# Altium schematic sheet Microcontroller.SchDoc
size A4; SheetNumber: 1; SheetTotal: 4
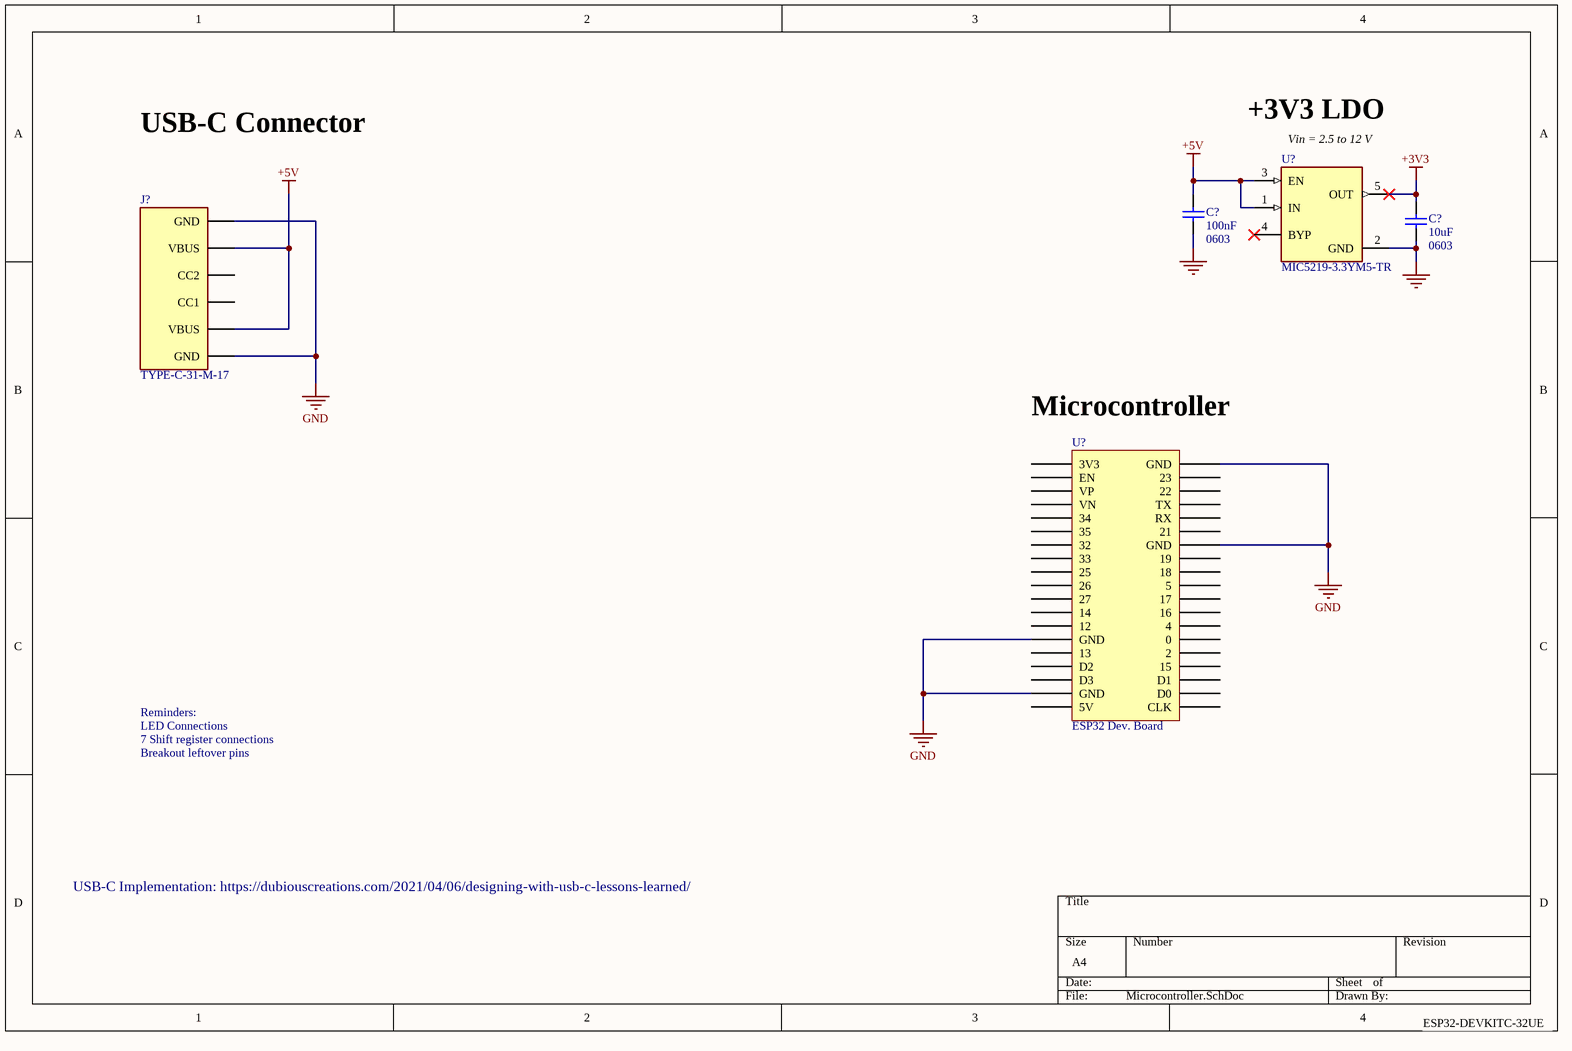
[diagram p0: Microcontroller.SchDoc]

## Parts
(Parts that share a designator on the sheet are numbered #1, #2 ... from top to bottom, then left to right.)
C?#1  100nF  value 0603  [0603 CAP SAMSUNG CL10C]
C?#2  10uF  value 0603  [0603 CAP]
J?  TYPE-C-31-M-17  [TYPEC31M17]
U?#1  MIC5219-3.3YM5-TR  [FP-SOT23-5LD-PL-1-IPC_C]
U?#2  ESP32 Dev. Board

## Nets
+3V3: C?#2.2 U?#1.5(OUT)
+5V: C?#1.2 J?.2(VBUS) J?.5(VBUS) U?#1.1(IN) U?#1.3(EN)
GND: C?#1.1 C?#2.1 J?.1(GND) J?.6(GND) U?#1.2(GND) U?#2.14(GND) U?#2.18(GND) U?#2.32(GND) U?#2.38(GND)

Not connected (* = marked no-connect by the designer): J? 3(CC1) 4(CC2); U?#1 4(BYP)*; U?#2 1(3V3) 2(EN) 3(VP) 4(VN) 5(34) 6(35) 7(32) 8(33) 9(25) 10(26) 11(27) 12(14) 13(12) 15(13) 16(D2) 17(D3) 19(5V) 20(CLK) 21(D0) 22(D1) 23(15) 24(2) 25(0) 26(4) 27(16) 28(17) 29(5) 30(18) 31(19) 33(21) 34(RX) 35(TX) 36(22) 37(23)

## Notes on the sheet
- USB-C Connector
- +3V3 LDO
- (near U?#1) Vin = 2.5 to 12 V
- (near U?#2) Microcontroller
- Reminders:
- LED Connections
- 7 Shift register connections
- Breakout leftover pins
- USB-C Implementation: https://dubiouscreations.com/2021/04/06/designing-with-usb-c-lessons-learned/
- ESP32-DEVKITC-32UE

## Library data of the parts
C?#1 C?#2 = Cap: Capacitor; Published: 8-Jun-2000; LatestRevisionDate: 17-Jul-2002; LatestRevisionNote: Re-released for DXP Platform.; PackageReference: RAD-0.3; Publisher: Altium Limited; PackageDescription: Radial Cap, Thru-Hole; 2 Leads; 0.3 in Pin Spacing
J? = TYPE-C-31-M-17: TYPE-C-31-M-17 HROPARTS; MF: HRO Electronics Co., Ltd.; SnapEDA_Link: https://www.snapeda.com/parts/TYPE-C-31-M-17/HRO+Electronics+Co.%252C+Ltd./view-part/?ref=snap; Package: Package; Value: *; MP: TYPE-C-31-M-17; Check_prices: https://www.snapeda.com/parts/TYPE-C-31-M-17/HRO+Electronics+Co.%252C+Ltd./view-part/?ref=eda
U?#1 = CMP-06324-000027-1: IC REG LINEAR 3.3V 500MA SOT23-5; Dropout Voltage: 350mV; Output Type: Fixed; Number of Regulators: 1; Max Input Voltage: 12V; Min Input Voltage: 2.5V; Min Operating Temperature: -40°C; Nominal Output Voltage: 3.3V; Output Voltage: 3.3V; Packaging: Cut Tape; Mount: Surface Mount; Number of Pins: 5; Case/Package: SOT-23-5; Lead Free: Lead Free; Max Operating Temperature: 125°C; REACH SVHC: No SVHC; Output Current: 500mA
U?#2 = ESP32 Dev. Board: ESP32-WROOM-32UE Series Evaluation Board 802.11 b/g/n (WiFi, WLAN) Bluetooth Smart Ready 4.x Dual Mode; Manufacturer: Espressif Systems; Manufacturer Part Number: ESP32-DEVKITC-32UE; Supplier: Digikey; Supplier Part Number: 1965-ESP32-DEVKITC-32UE-ND; RoHS: No; Category: RF Semiconductors and Devices; Stock: 498; Pricing: 1=10 (USD); ComponentLink1URL: https://www.espressif.com/sites/default/files/documentation/espressif_products_ordering_information_en.pdf?src-supplier=Digikey; ComponentLink1Description: https://www.espressif.com/sites/default/files/documentation/espressif_products_ordering_information_en.pdf?src-supplier=Digikey; ComponentLink2URL: https://datasheet.octopart.com/ESP32-DEVKITC-32UE-Espressif-Systems-datasheet-165560559.pdf?src-supplier=TME; ComponentLink2Description: https://datasheet.octopart.com/ESP32-DEVKITC-32UE-Espressif-Systems-datasheet-165560559.pdf?src-supplier=TME